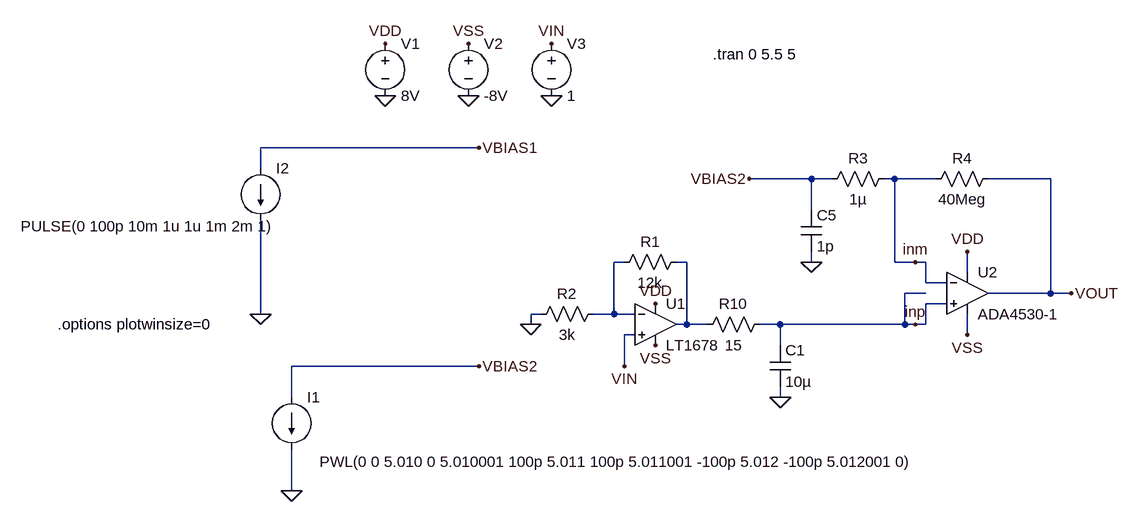
[diagram p0: schematic TIAwithDelayDataSave.asc]
TIAwithDelayDataSave.asc, the LTspice schematic file:
Version 4
SHEET 1 1080 680
WIRE -144 -160 -480 -160
WIRE -480 -128 -480 -160
WIRE 368 -112 272 -112
WIRE 400 -112 368 -112
WIRE 496 -112 480 -112
WIRE 560 -112 496 -112
WIRE 736 -112 640 -112
WIRE 368 -64 368 -112
WIRE 80 16 64 16
WIRE 176 16 160 16
WIRE 368 16 368 0
WIRE 496 16 496 -112
WIRE 528 16 496 16
WIRE 544 16 528 16
WIRE 608 32 608 0
WIRE 544 48 544 16
WIRE 576 48 544 48
WIRE 544 64 512 64
WIRE 672 64 640 64
WIRE 736 64 736 -112
WIRE 736 64 672 64
WIRE 768 64 736 64
WIRE 576 80 544 80
WIRE -480 96 -480 -48
WIRE -48 96 -64 96
WIRE 64 96 64 16
WIRE 64 96 32 96
WIRE 96 96 64 96
WIRE -64 112 -64 96
WIRE 176 112 176 16
WIRE 176 112 160 112
WIRE 208 112 176 112
WIRE 320 112 288 112
WIRE 512 112 512 64
WIRE 512 112 320 112
WIRE 528 112 512 112
WIRE 544 112 544 80
WIRE 544 112 528 112
WIRE 96 128 80 128
WIRE 608 128 608 96
WIRE 320 144 320 112
WIRE -144 176 -432 176
WIRE 80 176 80 128
WIRE -432 224 -432 176
WIRE 320 224 320 208
WIRE -432 368 -432 304
FLAG 320 224 0
FLAG -64 112 0
FLAG 368 16 0
FLAG -288 -320 VDD
FLAG 128 80 VDD
FLAG -160 -320 VSS
FLAG 128 144 VSS
FLAG 608 128 VSS
FLAG 608 0 VDD
FLAG -32 -320 VIN
FLAG -32 -240 0
FLAG -160 -240 0
FLAG -288 -240 0
FLAG 80 176 VIN
FLAG 768 64 VOUT
FLAG 528 16 inm
FLAG 528 112 inp
FLAG -480 96 0
FLAG -432 368 0
FLAG -144 -160 VBIAS1
FLAG -144 176 VBIAS2
FLAG 272 -112 VBIAS2
SYMBOL Opamps\\LT1678 128 112 R0
SYMATTR InstName U1
SYMBOL res 48 80 R90
WINDOW 0 0 56 VBottom 2
WINDOW 3 32 56 VTop 2
SYMATTR InstName R2
SYMATTR Value 3k
SYMBOL res 176 0 R90
WINDOW 0 0 56 VBottom 2
WINDOW 3 32 56 VTop 2
SYMATTR InstName R1
SYMATTR Value 12k
SYMBOL res 304 96 R90
WINDOW 0 0 56 VBottom 2
WINDOW 3 32 56 VTop 2
SYMATTR InstName R10
SYMATTR Value 15
SYMBOL cap 304 144 R0
SYMATTR InstName C1
SYMATTR Value 10µ
SYMBOL cap 352 -64 R0
SYMATTR InstName C5
SYMATTR Value 1p
SYMBOL res 656 -128 R90
WINDOW 0 0 56 VBottom 2
WINDOW 3 32 56 VTop 2
SYMATTR InstName R4
SYMATTR Value 40Meg
SYMBOL voltage -288 -336 R0
WINDOW 123 0 0 Left 0
WINDOW 39 0 0 Left 0
SYMATTR InstName V1
SYMATTR Value 8V
SYMBOL voltage -160 -336 R0
WINDOW 123 0 0 Left 0
WINDOW 39 0 0 Left 0
SYMATTR InstName V2
SYMATTR Value -8V
SYMBOL voltage -32 -336 R0
WINDOW 123 0 0 Left 0
WINDOW 39 0 0 Left 0
SYMATTR InstName V3
SYMATTR Value 1
SYMBOL current -432 224 R0
WINDOW 123 0 0 Left 0
WINDOW 39 0 0 Left 0
WINDOW 3 43 99 Left 2
SYMATTR Value PWL(0 0 5.010 0 5.010001 100p 5.011 100p 5.011001 -100p 5.012 -100p 5.012001 0)
SYMATTR InstName I1
SYMBOL res 496 -128 R90
WINDOW 0 0 56 VBottom 2
WINDOW 3 32 56 VTop 2
SYMATTR InstName R3
SYMATTR Value 1µ
SYMBOL current -480 -128 R0
WINDOW 123 0 0 Left 0
WINDOW 39 0 0 Left 0
WINDOW 3 -369 89 Left 2
SYMATTR Value PULSE(0 100p 10m 1u 1u 1m 2m 1)
SYMATTR InstName I2
SYMBOL Opamps\\ADA4530-1 608 64 R0
SYMATTR InstName U2
TEXT 216 -304 Left 2 !.tran 0 5.5 5
TEXT -792 112 Left 2 !.options plotwinsize=0

The netlist it stands for:
* TIAwithDelayDataSave.asc
XU1 VIN N001 N002 VDD VSS LT1678  ; pins In+ In- OUT V+ V-
R2 N001 0 3k
R1 N002 N001 12k
R10 inp N002 15
C1 inp 0 10µ
C5 VBIAS2 0 1p
R4 VOUT inm 40Meg
V1 VDD 0 8V
V2 VSS 0 -8V
V3 VIN 0 1
I1 VBIAS2 0 PWL(0 0 5.010 0 5.010001 100p 5.011 100p 5.011001 -100p 5.012 -100p 5.012001 0)
R3 inm VBIAS2 1µ
I2 VBIAS1 0 PULSE(0 100p 10m 1u 1u 1m 2m 1)
* U2: ADA4530-1 (symbol Opamps\ADA4530-1 not available, pins judged from their places): In+=inp In-=inm V+=VDD V-=VSS OUT=VOUT
.tran 0 5.5 5
.options plotwinsize=0
.backanno
.end